# EAGLE design rapidshark-main-breakout-top-teensy-mk-1.1 (EAGLE 7.5.0)
AUTHOR: sean@yak.net
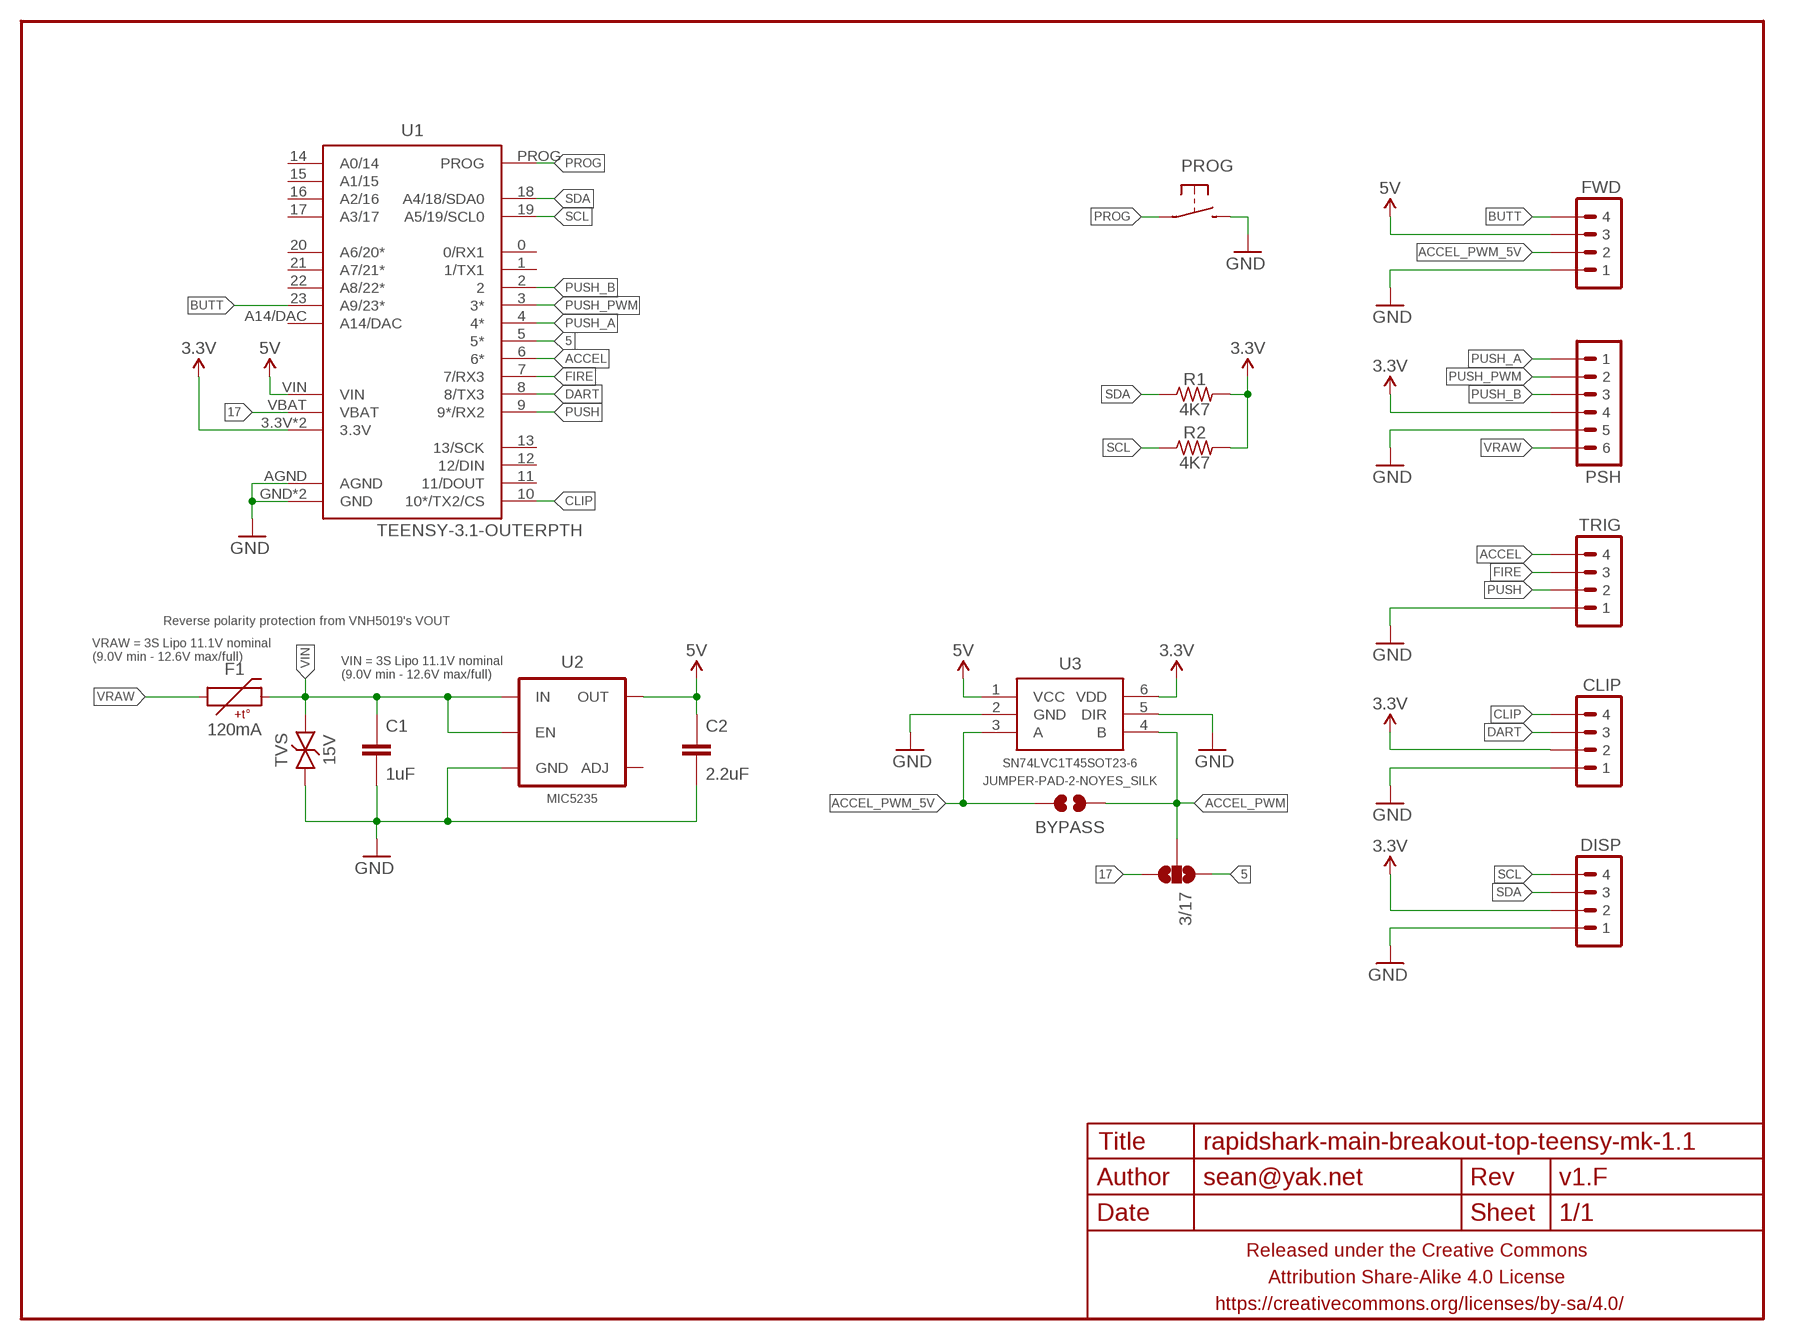
[diagram p0: schematic, sheet 1]

## Parts
3/17  JUMPER-PAD-3-NOSMALLER  [PAD-JUMPER-3-NO_YES_SILK_FULL_BOX_SMALLER]
BYPASS  JUMPER-PAD-2-NOYES_SILK  [PAD-JUMPER-2-NO_YES_SILK]
C1  1uF  CAPACITOR-CERAMICC0603-TIGHTER  [C0603-TIGHTER]
C2  2.2uF  CAPACITOR-CERAMICC0603-TIGHTER  [C0603-TIGHTER]
CLIP  M04JST-PTH-VERT  [JST-4-PH-VERT-PTH]
DISP  M04JST-PTH-VERT  [JST-4-PH-VERT-PTH]
F1  120mA  PTCSMD  [PTC-1206]
FRAME1  FRAME-LETTERNO_PACKAGE  [DUMMY]
FWD  M04JST-PTH-VERT  [JST-4-PH-VERT-PTH]
PROG  SPST-NO-TACTCK-PTS840-GK  [TACTILE-SMD-CK-PTS840-GK]
PSH  M06JST-PH-PTH-VERT  [JST-6-PH-VERT-PTH]
R1  4K7  RESISTORR0603-TIGHTER  [R0603-TIGHTER]
R2  4K7  RESISTORR0603-TIGHTER  [R0603-TIGHTER]
TRIG  M04JST-PTH-VERT  [JST-4-PH-VERT-PTH]
TVS  15V  TVSSMA  [SMA-DIODE-TVS-BIDIR]
U1  TEENSY-3.1-OUTERPTH  [TEENSY-3.1_OUTERONLY]
U2  MIC5235  V_REG_MIC5235  [SOT23-5]
U3  SN74LVC1T45SOT23-6  [SOT23-6]

## Nets
3.3V: CLIP.2 DISP.2 PSH.4 R1.2 R2.2 U1.3.3V U1.3V(3.3V) U3.6(VDD)
5: 3/17.1 U1.5(5*)
5V: C2.1 FWD.3 U1.VIN U2.5(OUT) U3.1(VCC)
17: 3/17.3 U1.VBAT
ACCEL: TRIG.4 U1.6(6*)
ACCEL_PWM: 3/17.2 BYPASS.1 U3.4(B)
ACCEL_PWM_5V: BYPASS.2 FWD.2 U3.3(A)
BUTT: FWD.4 U1.23(A9/23*)
CLIP: CLIP.4 U1.10(10*/TX2/CS)
DART: CLIP.3 U1.8(8/TX3)
FIRE: TRIG.3 U1.7(7/RX3)
GND: C1.2 C2.2 CLIP.1 DISP.1 FWD.1 PROG.3 PROG.4 PSH.5 TRIG.1 TVS.1 U1.AGND U1.GND U1.GND1(GND) U2.2(GND) U3.2(GND) U3.5(DIR)
PROG: PROG.1 PROG.2 U1.PROG
PUSH: TRIG.2 U1.9(9*/RX2)
PUSH_A: PSH.1 U1.4(4*)
PUSH_B: PSH.3 U1.2
PUSH_PWM: PSH.2 U1.3(3*)
SCL: DISP.4 R2.1 U1.19(A5/19/SCL0)
SDA: DISP.3 R1.1 U1.18(A4/18/SDA0)
VIN: C1.1 F1.2 TVS.2 U2.1(IN) U2.3(EN)
VRAW: F1.1 PSH.6
Unconnected: U1.0(0/RX1) U1.1(1/TX1) U1.11(11/DOUT) U1.12(12/DIN) U1.13(13/SCK) U1.14(A0/14) U1.15(A1/15) U1.16(A2/16) U1.17(A3/17) U1.20(A6/20*) U1.21(A7/21*) U1.22(A8/22*) U1.A14/DAC U2.4(ADJ)

## Notes on the sheet
- Reverse polarity protection from VNH5019's VOUT
- VRAW = 3S Lipo 11.1V nominal
  (9.0V min - 12.6V max/full)
- VIN = 3S Lipo 11.1V nominal
  (9.0V min - 12.6V max/full)

## Library data of the parts
3/17 = a_parts:JUMPER-PAD-3-NO
BYPASS = a_parts:JUMPER-PAD-2-NO
C1 C2 = a_parts:CAPACITOR-CERAMIC: CAPACITOR, European symbol
CLIP DISP FWD TRIG = a_parts:M04: Header 4 Standard 4-pin 0.1" header. Use with straight break away headers (SKU : PRT-00116), right angle break away headers (PRT-00553), swiss pins (PRT-00743), machine pins (PRT-00117), and female headers (PRT-00115). Molex polarized connector foot print use with SKU : PRT-08231 with associated crimp pins and housings. 1MM SMD Version SKU: PRT-10208
F1 = a_parts:PTC: Resettable Fuse PTC Resettable Fuse. Spark Fun Electronics SKU : COM-08357; PROD_ID: RES-11150
FRAME1 = a_parts:FRAME-LETTER: Schematic Frame Standard 8.5x11 US Letter frame; DESIGNER: sean@yak.net; VERSION: v1.F
PROG = a_parts:SPST-NO-TACT
PSH = a_parts:M06: Header 6 Standard 6-pin 0.1" header. Use with straight break away headers (SKU : PRT-00116), right angle break away headers (PRT-00553), swiss pins (PRT-00743), machine pins (PRT-00117), and female headers (PRT-00115). Molex polarized connector foot print use with SKU : PRT-08094 with associated crimp pins and housings. NOTES ON THE VARIANTS LOCK and LOCK_LONGPADS... This footprint was designed to help hold the alignment of a through-hole component (i.e. 6-pin header) while soldering it into place. You may notice that each hole has been shifted either up or down by 0.005 of an inch from it's more standard position (which is a perfectly straight line). This slight alteration caused the pins (the squares in the middle) to touch the edges of the holes. Because they are alternating, it causes a "brace" to hold the component in place. 0.005 has proven to be the perfect amount of "off-center" position when using our standard breakaway headers. Although looks a little odd when you look at the bare footprint, once you have a header in there, the alteration is very hard to notice. Also,if you push a header all the way into place, it is covered up entirely on the bottom side. This idea of altering the position of holes to aid alignment will be further integrated into the Sparkfun Library for other footprints. It can help hold any component with 3 or more connection pins.
R1 R2 = a_parts:RESISTOR: RESISTOR, American symbol
TVS = a_parts:TVS: Transient voltage suppressor- prevents ESD on inputs. Ignore package description- MBRA140 is NOT this type of part!!!
U1 = a_parts:TEENSY-3.1-OUTER
U2 = a_parts:V_REG_MIC5235
U3 = a_parts:SN74LVC1T45

## Board
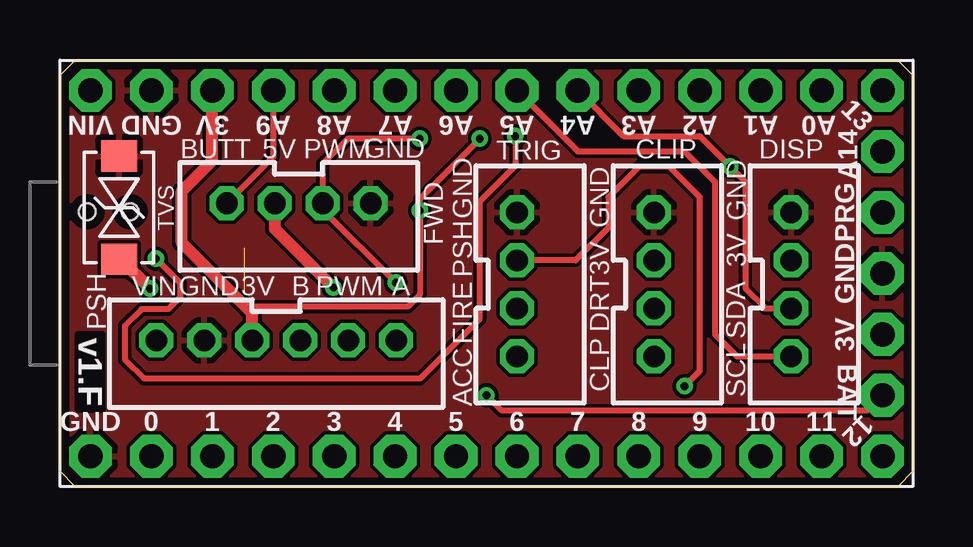
[diagram p1: board, top side]
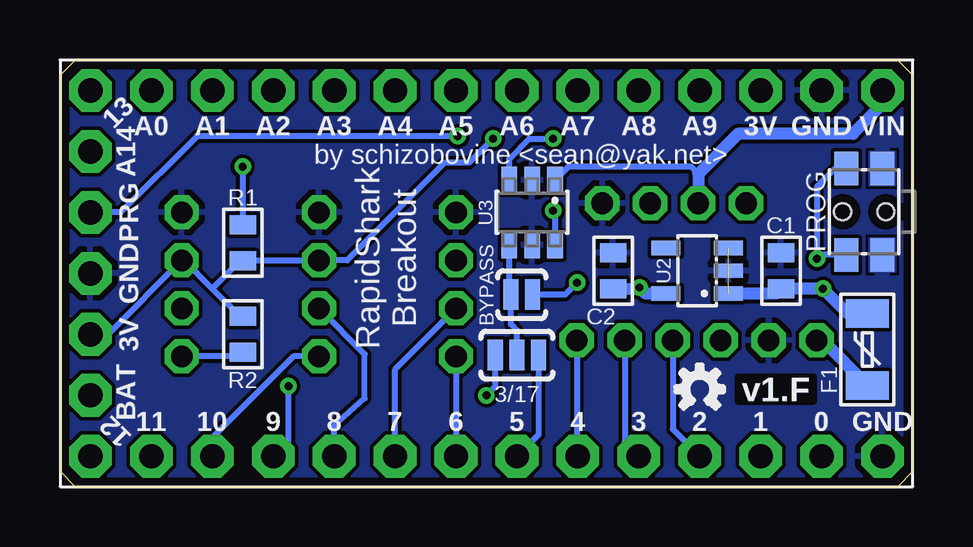
[diagram p2: board, bottom side, seen from below]

Size 35.56 x 17.78 mm. Coordinates in mm from the lower left corner, seen from the top.
Outline: 34.92,0 0.64,0 0,0.64 0,17.14 0.64,17.78 34.92,17.78 35.56,17.14 35.56,0.64 34.92,0
Copper layers (1*16): Top 0.0356mm / dielectric 1.5011mm / Bottom 0.0356mm
Design rules "LaenPCBOrder_2": minimum track width 6mil, minimum drill 13mil, track to track 6mil, track to pad 6mil, pad to pad 6mil, via to via 6mil, smd to smd 6mil, copper to edge 15mil, drill to drill 6mil, minimum pad ring 7mil, minimum via ring 7mil, stop-mask expansion 3mil, vias tented up to drill 20mil, thermal gap 10mil

### Footprints (pad centres in the part's own frame; a part is rotated, then mirrored left to right if it is on the bottom)
PAD-JUMPER-3-NO_YES_SILK_FULL_BOX_SMALLER = smd 0.635 x 1.27: 1 -0.9,0; 2 0,0; 3 0.9,0
PAD-JUMPER-2-NO_YES_SILK = smd 0.635 x 1.27: 1 -0.45,0; 2 0.45,0
C0603-TIGHTER = smd 0.8 x 1.1: 1 -0.75,0; 2 0.75,0
JST-4-PH-VERT-PTH = drill 0.9 pad 1.422 octagon: 1 0,0; 2 2,0; 3 4,0; 4 6,0
PTC-1206 = smd 1.2 x 1.8: 1 -1.5,0; 2 1.5,0
TACTILE-SMD-CK-PTS840-GK = smd 1.4 x 1: 1 -1.8,0.75; 2 1.8,0.75; 3 -1.8,-0.75; 4 1.8,-0.75 | hole 0.7: 0,-0.9; 0,0.9
JST-6-PH-VERT-PTH = drill 0.9 pad 1.422 octagon: 1 -5,0; 2 -3,0; 3 -1,0; 4 1,0; 5 3,0; 6 5,0
R0603-TIGHTER = smd 0.8 x 1.1: 1 -0.75,0; 2 0.75,0
SMA-DIODE-TVS-BIDIR = smd 1.3 x 1.5: 1 -2.15,0; 2 2.15,0
TEENSY-3.1_OUTERONLY = drill 1.016 pad 1.778 octagon: 0 7.62,-13.97; 1 7.62,-11.43; 2 7.62,-8.89; 3 7.62,-6.35; 3.3V 2.54,16.51; 3V -7.62,-11.43; 4 7.62,-3.81; 5 7.62,-1.27; 6 7.62,1.27; 7 7.62,3.81; 8 7.62,6.35; 9 7.62,8.89; 10 7.62,11.43; 11 7.62,13.97; 12 7.62,16.51; 13 -7.62,16.51; 14 -7.62,13.97; 15 -7.62,11.43; 16 -7.62,8.89; 17 -7.62,6.35; 18 -7.62,3.81; 19 -7.62,1.27; 20 -7.62,-1.27; 21 -7.62,-3.81; 22 -7.62,-6.35; 23 -7.62,-8.89; A14/DAC -5.08,16.51; AGND -7.62,-13.97; GND 0,16.51; GND1 7.62,-16.51; PROG -2.54,16.51; VBAT 5.08,16.51; VIN -7.62,-16.51
SOT23-5 = smd 0.6 x 1.2: 1 -0.95,-1.3; 2 0,-1.3; 3 0.95,-1.3; 4 0.95,1.3; 5 -0.95,1.3
SOT23-6 = smd 0.65 x 1.1: 1 -0.95,-1.35; 2 0,-1.35; 3 0.95,-1.35; 4 0.95,1.35; 5 0,1.35; 6 -0.95,1.35

### Placement (x,y rotation side)
3/17  16.51,5.49 180 bottom
BYPASS  16.31,8 0 bottom
C1  5.5,9 90 bottom
C2  12.5,9 90 bottom
CLIP  24.77,11.43 270 top
DISP  30.48,11.43 270 top
F1  1.91,5.71 90 bottom
FRAME1  0,0 270 bottom
FWD  12.95,11.81 180 top
PROG  2.03,11.46 90 bottom
PSH  9.02,6.1 180 top
R1  27.94,10.16 270 bottom
R2  27.94,6.35 90 bottom
TRIG  19.05,11.43 270 top
TVS  2.46,11.63 270 top
U1  17.78,8.89 270 top
U2  9,9 90 bottom
U3  15.88,11.43 180 bottom
U$3  [OSHWLOGO_TINY_SILKONLY]  8.89,4.06 0 bottom

### Tracks (layer width: path | path; a pad name or v marks a point on that pad's centre or on a via)
3.3V  (via drill 0.33)
  Top 0.254: 7.82,7.42 7.9,7.5 14.5,7.5 15,8 v15,11.5 15,12 v17.5,14.5
  Top 0.508: PSH.4 8.02,7.22 7.82,7.42 5.08,10.16 5.08,12.32 6.35,13.59 U1.3V
  Bottom 0.254: R2.2 28.05,7.1 29.21,8.26 | 29.21,8.26 30.39,9.43 DISP.2 33.56,6.35 U1.3.3V | 29.21,8.26 28.05,9.41 R1.2 27.92,9.43 CLIP.2 23.59,9.43 19.53,13.49 18.5,13.5 v17.5,14.5 | v15,11.5 14.93,11.43 U3.6
5
  Bottom 0.254: 3/17.1 15.61,2.17 U1.5
5V  (via drill 0.33)
  Top 0.508: FWD.3 8.95,10.75 v11.4,8.3
  Bottom 0.254: FWD.3 8.95,12.13 | U3.1 14.37,13.34 9.24,13.34 8.95,13.05
  Bottom 0.508: U1.VIN 1.27,15.93 2.5,14.7 7.3,14.7 8.95,13.05 FWD.3 | U2.5 11.15,8.05 v11.4,8.3 11.45,8.25 C2.1
17  (via drill 0.33)
  Top 0.254: U1.VBAT 33.66,3.17 18.41,3.17 v17.78,3.81
  Bottom 0.254: v17.78,3.81 17.41,4.18 3/17.3
ACCEL
  Bottom 0.254: TRIG.4 U1.6
ACCEL_PWM
  Bottom 0.254: 3/17.2 16.5,6.5 16.76,6.76 BYPASS.1 16.82,8.06 U3.4
ACCEL_PWM_5V  (via drill 0.33)
  Top 0.254: v15,14.5 12,14.5 10.95,13.45 FWD.2 10.95,11.55 v14,8.5
  Bottom 0.254: U3.3 16.82,13.68 16,14.5 v15,14.5 | v14,8.5 14.5,8 BYPASS.2
BUTT
  Top 0.254: U1.23 8.89,13.75 FWD.4
CLIP
  Bottom 0.254: CLIP.4 25.81,5.43 29.21,2.03 U1.10
DART
  Bottom 0.254: U1.8 24.13,2.54 22.86,3.68 22.86,5.53 CLIP.3
FIRE
  Bottom 0.254: U1.7 21.59,4.89 TRIG.3
GND
  pour Top (rank 6): 34.92,0 0.64,0 0,0.64 0,17.14 0.64,17.78 34.92,17.78 35.56,17.14 35.56,0.64
  pour Bottom (rank 6): 34.92,0 0.64,0 0,0.64 0,17.14 0.64,17.78 34.92,17.78 35.56,17.14 35.56,0.64
PROG  (via drill 0.33)
  Top 0.254: v4,9.5 5,8.5 5,7.9 4.5,7.4 3.4,7.4 2.7,6.7 2.7,5.3 3.5,4.5 15,4.5 17.5,7 17.5,11.9 19,13.4 19,14.59 v18.98,14.61
  Bottom 0.254: v18.98,14.61 29.84,14.61 33.02,11.43 U1.PROG | PROG.1 3.84,9.66 v4,9.5 4,12.5 3.24,13.26 PROG.2
PUSH  (via drill 0.33)
  Top 0.254: TRIG.2 21.5,9.43 22.86,10.79 22.86,12.06 24.13,13.34 25.4,13.34 26.67,12.06 26.67,4.83 v26.04,4.19
  Bottom 0.254: U1.9 26.04,1.91 v26.04,4.19
PUSH_A
  Bottom 0.254: PSH.1 14.02,1.32 U1.4
PUSH_B
  Bottom 0.254: PSH.3 10.02,2.4 U1.2
PUSH_PWM
  Bottom 0.254: PSH.2 12.02,1.86 U1.3
SCL
  Top 0.254: U1.19 21.59,13.97 26.04,13.97 27.3,12.7 27.3,6.35 28.23,5.43 DISP.4
  Bottom 0.254: R2.1 28.11,5.43 DISP.4
SDA  (via drill 0.33)
  Top 0.254: U1.18 23.5,14.61 26.67,14.61 v27.94,13.34 28.57,12.7 28.57,8.26 29.4,7.43 DISP.3
  Bottom 0.254: v27.94,13.34 R1.1
VIN  (via drill 0.33)  (1 unrouted)
  Top 0.508: v3.75,8.25 2.52,9.48 TVS.2
  Bottom 0.508: F1.2 2.71,7.21 v3.75,8.25 C1.1 5.7,8.05 U2.1
VRAW
  Bottom 0.508: PSH.6 3.79,6.1 F1.1

### Text on the board
tPlace: BUTT | 5V | PWM | GND | GND | GND | GND | PSH | 3V | 3V | VIN | GND | 3V | B | PWM | A | DRT | FIRE | SDA | ACC | CLP | SCL
bPlace: by schizobovine <sean@yak.net> | RapidShark / Breakout